# EAGLE schematic mw_itb_full_v1.7.2 (EAGLE 6.4)
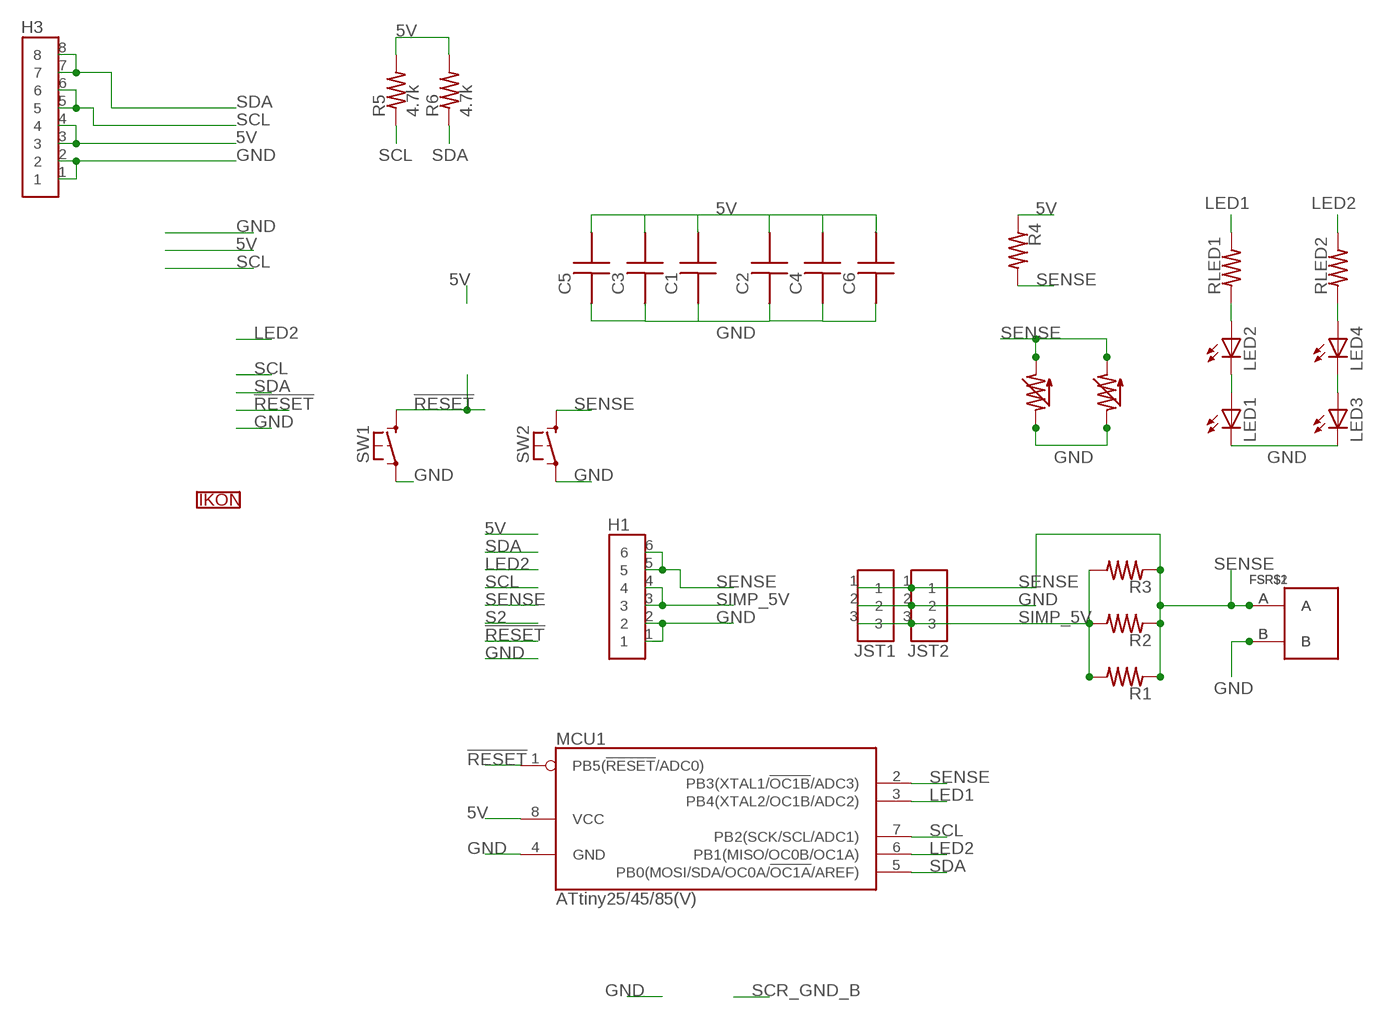
[diagram p0: schematic, sheet 1]

## Parts
C1  CAPACITOR1206  [1206_YAGEO]
C2  CAPACITOR1206  [1206_YAGEO]
C3  CAPACITOR0805  [0805_YAGEO]
C4  CAPACITOR0805  [0805_YAGEO]
C5  CAPACITOR0603  [0603_YAGEO]
C6  CAPACITOR0603  [0603_YAGEO]
FSR$1  FSR_PAD88X44_P2B  [FSR_PAD_88X44_P2B]
FSR$2  FSR_PAD88X44_P2B  [FSR_PAD_88X44_P2B]
H1  HEADER_6P-0.1"_2X3-SMD-SULLINS  [HEADER-0.1"_2X3-SMD-SULLINS]
H3  HEADER_8P-0.1"_2X4-SMD-SULLINS  [HEADER-0.1"_2X4-SMD-SULLINS]
JST1  JST-3-PH-SMD-TOP  [JST_PH_SMD_3_TOP]
JST2  JST-3-PH-SMD-TOP  [JST_PH_SMD_3_TOP]
LED1  LED-ZBEND_RM  [Z-BEND_RM]
LED2  LED-ZBEND_RM  [Z-BEND_RM]
LED3  LED-ZBEND_RM  [Z-BEND_RM]
LED4  LED-ZBEND_RM  [Z-BEND_RM]
MCU1  ATMEL_ATTINY25/45/85(V)-SOIC_DUAL  [SOIC-8_DUAL]
R1  RESISTOR1206  [1206_YAGEO]
R2  RESISTOR0805  [0805_YAGEO]
R3  RESISTOR0603  [0603_YAGEO]
R4  RESISTOR0603  [0603_YAGEO]
R5  4.7k  RESISTOR0603  [0603_YAGEO]
R6  4.7k  RESISTOR0603  [0603_YAGEO]
RLED1  RESISTOR0603  [0603_YAGEO]
RLED2  RESISTOR0603  [0603_YAGEO]
SW1  SWITCH_SPST-KMT0  [KMT0]
SW2  SWITCH_SPST-KMT0  [KMT0]
U$1  FSR_PINS  FSR_PINSJUMBO_SMD  [FSR_0.1"-PITCH_PADS-0.05"X0.5"]
U$2  FSR_PLACE  FSR_PLACE1.5"SQR  [FSR_1.5[IN]_SQR]
U$3  FSR_PINS  FSR_PINSJUMBO_SMD  [FSR_0.1"-PITCH_PADS-0.05"X0.5"]
U$4  FSR_PLACE  FSR_PLACE1.5"SQR  [FSR_1.5[IN]_SQR]
U$5  FSR_PLACE  FSR_PLACE1.5"SQR  [FSR_1.5[IN]_SQR]
U$6  FSR_PLACE  FSR_PLACE1.5"SQR  [FSR_1.5[IN]_SQR]
U$9  FSR_PINS  FSR_PINSJUMBO_SMD  [FSR_0.1"-PITCH_PADS-0.05"X0.5"]
U$10  FSR_PINS  FSR_PINSJUMBO_SMD  [FSR_0.1"-PITCH_PADS-0.05"X0.5"]
U$11  IKONLEARNING-20MIL  [IKON_LEARNING_20MIL]

## Nets
5V: C1.1 C2.1 C3.1 C4.1 C5.1 C6.1 H3.3 H3.4 MCU1.8(VCC) R4.1 R5.2 R6.2
!RESET: MCU1.1(PB5(!RESET!/ADC0)) SW1.1@1 SW1.1@2
GND: C1.2 C2.2 C3.2 C4.2 C5.2 C6.2 FSR$1.B FSR$2.B H1.1 H1.2 H3.1 H3.2 JST1.2 JST2.2 LED1.K(C) LED3.K(C) MCU1.4(GND) SW1.2@1 SW1.2@2 SW2.2@1 SW2.2@2 U$1.P$1 U$3.P$2 U$9.P$2 U$10.P$1
LED1: MCU1.3(PB4(XTAL2/OC1B/ADC2)) RLED1.2
LED2: MCU1.6(PB1(MISO/OC0B/OC1A)) RLED2.2
N$1: LED2.A RLED1.1
N$2: LED1.A LED2.K(C)
N$3: LED4.A RLED2.1
N$4: LED3.A LED4.K(C)
SCL: H3.5 H3.6 MCU1.7(PB2(SCK/SCL/ADC1)) R5.1
SDA: H3.7 H3.8 MCU1.5(PB0(MOSI/SDA/OC0A/!OC1A!/AREF)) R6.1
SENSE: FSR$1.A FSR$2.A H1.5 H1.6 JST1.1 JST2.1 MCU1.2(PB3(XTAL1/!OC1B!/ADC3)) R1.1 R2.1 R3.1 R4.2 SW2.1@1 SW2.1@2 U$1.P$2 U$3.P$1 U$9.P$1 U$10.P$2
SIMP_5V: H1.3 H1.4 JST1.3 JST2.3 R1.2 R2.2 R3.2

## Library data of the parts
C1-C6 = NaN:CAPACITOR
FSR$1 FSR$2 = NaN:FSR_PAD
H1 = NaN:HEADER_6P
H3 = NaN:HEADER_8P
JST1 JST2 = NaN:JST-3
LED1-LED4 = NaN:LED: LEDs
MCU1 = NaN:ATMEL_ATTINY25/45/85(V)
R1-R6 RLED1 RLED2 = NaN:RESISTOR
SW1 SW2 = NaN:SWITCH_SPST
U$1 U$3 U$9 U$10 = NaN:FSR_PINS
U$2 U$4-U$6 = NaN:FSR_PLACE
U$11 = NaN:IKON